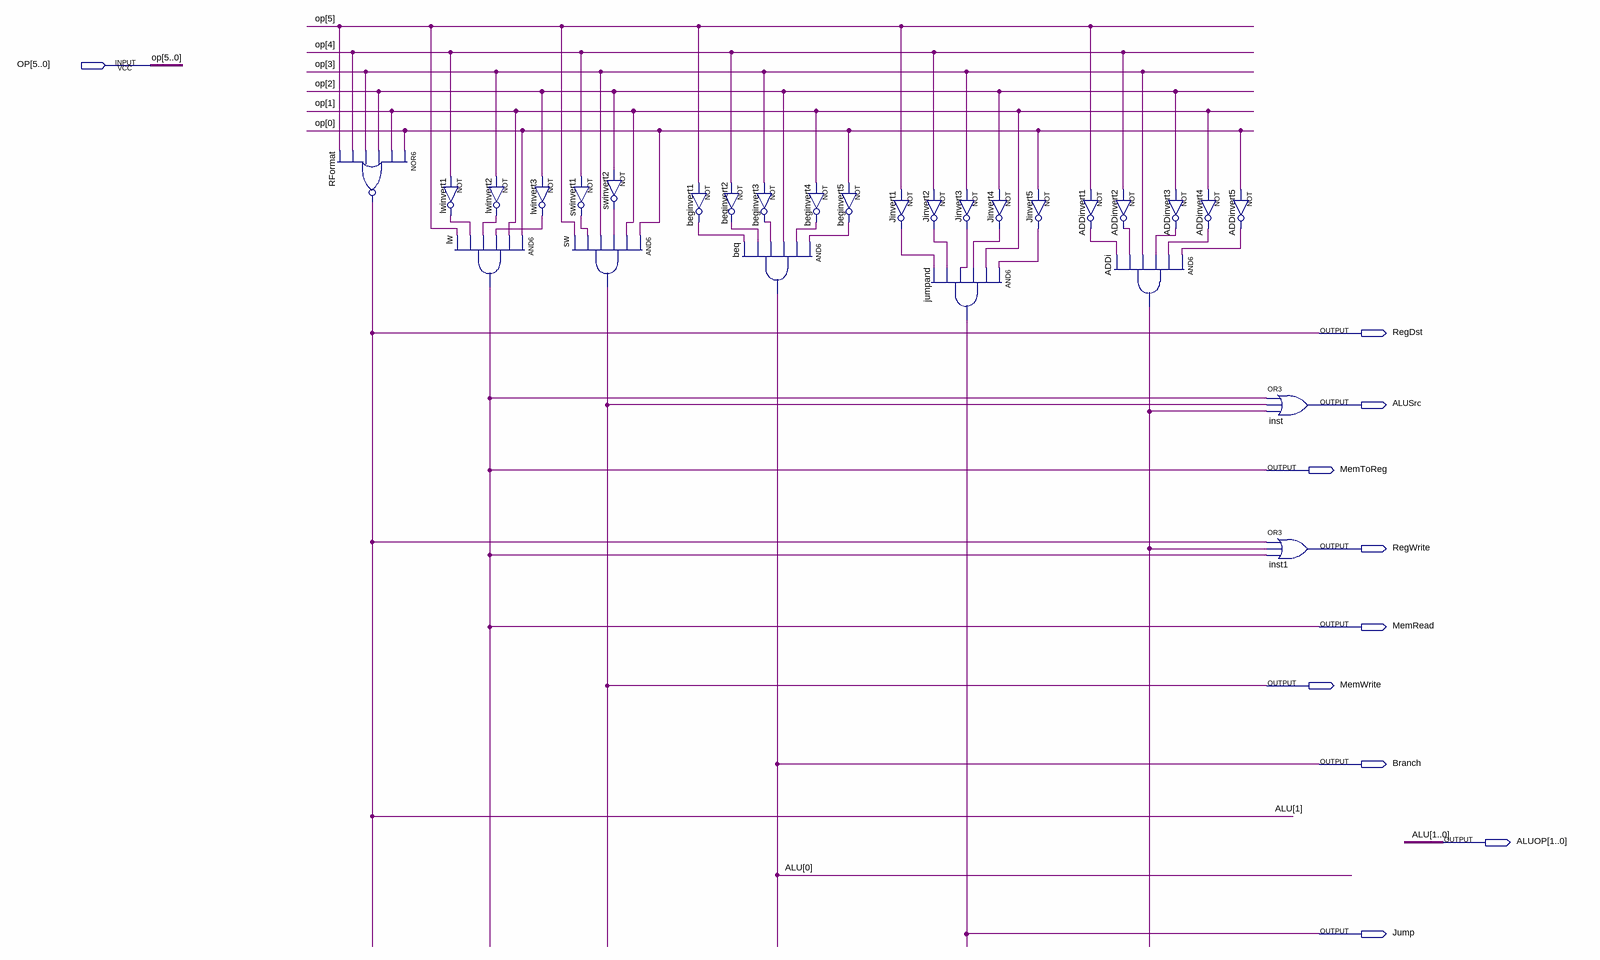
[diagram p0: schematic sheet]
// Quartus schematic GlobalControl.bdf as structural Verilog: 28 symbols, 10 pins
module GlobalControl (
  input  [5:0] OP,
  output RegDst,
  output ALUSrc,
  output MemToReg,
  output RegWrite,
  output MemRead,
  output MemWrite,
  output Branch,
  output [1:0] ALUOP,
  output Jump
);

  wire ADDi_out, ADDinvert1_out, ADDinvert2_out, ADDinvert3_out, ADDinvert4_out, ADDinvert5_out,
       beginvert1_out, beginvert3_out, beginvert4_out, beginvert5_out, beqinvert2_out, Jinvert1_out,
       Jinvert2_out, Jinvert3_out, Jinvert4_out, Jinvert5_out, lwinvert1_out, lwinvert2_out, lwinvert3_out,
       swinvert1_out, swinvert2_out;

  nor RFormat (ALUOP[1], OP[0], OP[1], OP[2], OP[3], OP[4], OP[5]);
  not lwinvert1 (lwinvert1_out, OP[4]);
  and lw (MemRead, OP[0], OP[1], lwinvert3_out, lwinvert2_out, lwinvert1_out, OP[5]);
  not lwinvert2 (lwinvert2_out, OP[3]);
  not lwinvert3 (lwinvert3_out, OP[2]);
  not swinvert1 (swinvert1_out, OP[4]);
  and sw (MemWrite, OP[0], OP[1], swinvert2_out, OP[3], swinvert1_out, OP[5]);
  not swinvert2 (swinvert2_out, OP[2]);
  not beginvert1 (beginvert1_out, OP[5]);
  not beqinvert2 (beqinvert2_out, OP[4]);
  not beginvert3 (beginvert3_out, OP[3]);
  and beq (ALUOP[0], beginvert5_out, beginvert4_out, OP[2], beginvert3_out, beqinvert2_out, beginvert1_out);
  not beginvert4 (beginvert4_out, OP[1]);
  not beginvert5 (beginvert5_out, OP[0]);
  not Jinvert1 (Jinvert1_out, OP[5]);
  not Jinvert2 (Jinvert2_out, OP[4]);
  and jumpand (Jump, Jinvert5_out, OP[1], Jinvert4_out, Jinvert3_out, Jinvert2_out, Jinvert1_out);
  not Jinvert3 (Jinvert3_out, OP[3]);
  not Jinvert4 (Jinvert4_out, OP[2]);
  not Jinvert5 (Jinvert5_out, OP[0]);
  not ADDinvert1 (ADDinvert1_out, OP[5]);
  not ADDinvert2 (ADDinvert2_out, OP[4]);
  and ADDi (ADDi_out, ADDinvert5_out, ADDinvert4_out, ADDinvert3_out, OP[3], ADDinvert2_out, ADDinvert1_out);
  not ADDinvert3 (ADDinvert3_out, OP[2]);
  not ADDinvert4 (ADDinvert4_out, OP[1]);
  not ADDinvert5 (ADDinvert5_out, OP[0]);
  or inst (ALUSrc, MemRead, MemWrite, ADDi_out);
  or inst1 (RegWrite, ALUOP[1], ADDi_out, MemRead);

  assign Branch = ALUOP[0];
  assign MemToReg = MemRead;
  assign RegDst = ALUOP[1];

  // Other names for the same wires on the sheet: ALU[1:0] = ALUOP
endmodule
